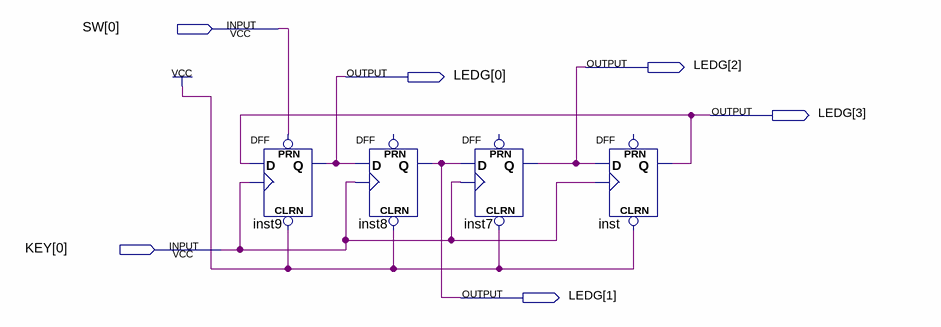
[diagram p0: schematic sheet]
// Quartus schematic shiftreg.bdf as structural Verilog: 4 symbols, 6 pins
module shiftreg (
  input  [0:0] SW,
  input  [0:0] KEY,
  output [3:0] LEDG
);

  DFF inst9 (.CLRN(1'b1), .CLK(KEY[0]), .D(LEDG[3]), .PRN(SW[0]), .Q(LEDG[0]));
  DFF inst8 (.CLRN(1'b1), .CLK(KEY[0]), .D(LEDG[0]), .Q(LEDG[1]));  // open: PRN
  DFF inst7 (.CLRN(1'b1), .CLK(KEY[0]), .D(LEDG[1]), .Q(LEDG[2]));  // open: PRN
  DFF inst (.CLRN(1'b1), .CLK(KEY[0]), .D(LEDG[2]), .Q(LEDG[3]));  // open: PRN
endmodule
